# Altium schematic sheet LM74910H_PINOUT.SchDoc
size B; SheetNumber: 14; SheetTotal: 21
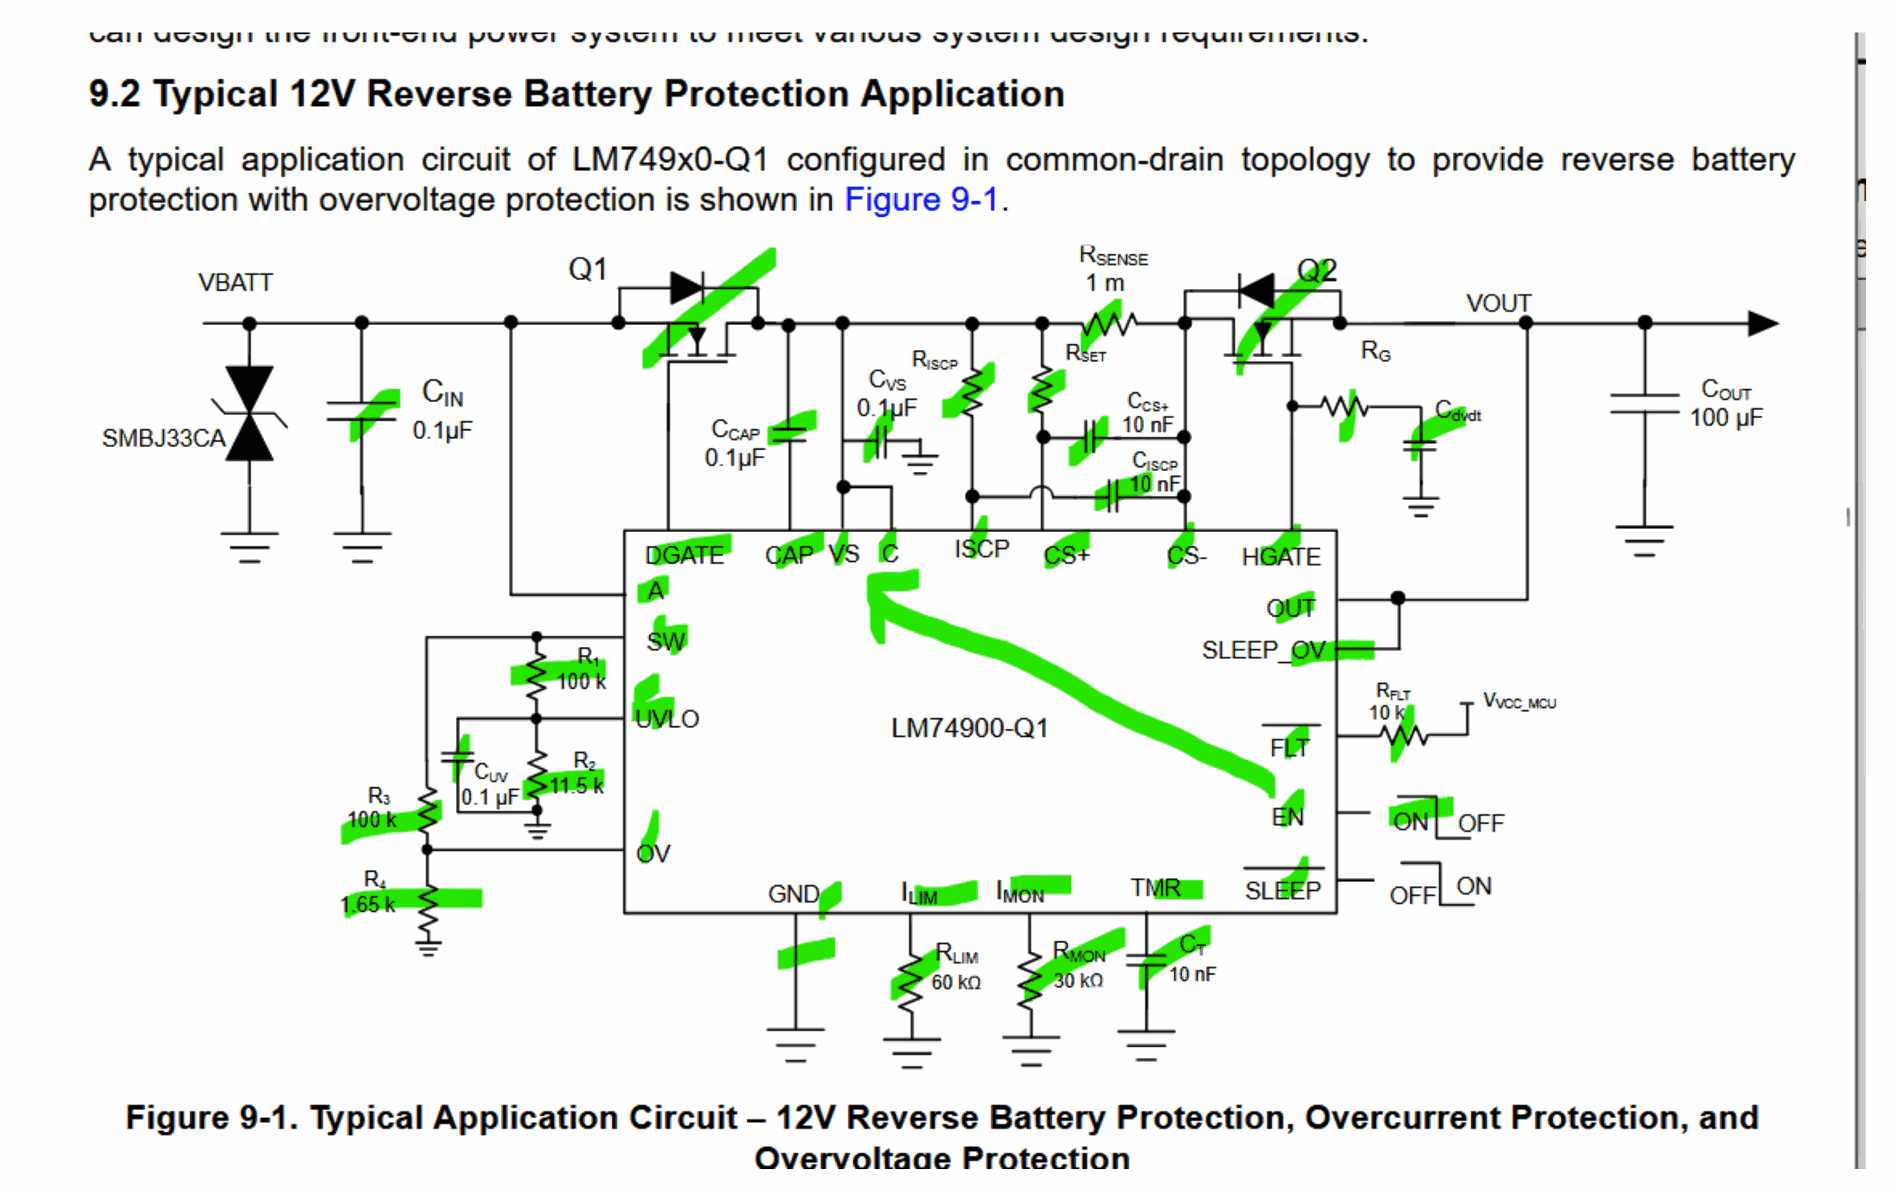
[diagram p0: LM74910H_PINOUT.SchDoc, top]
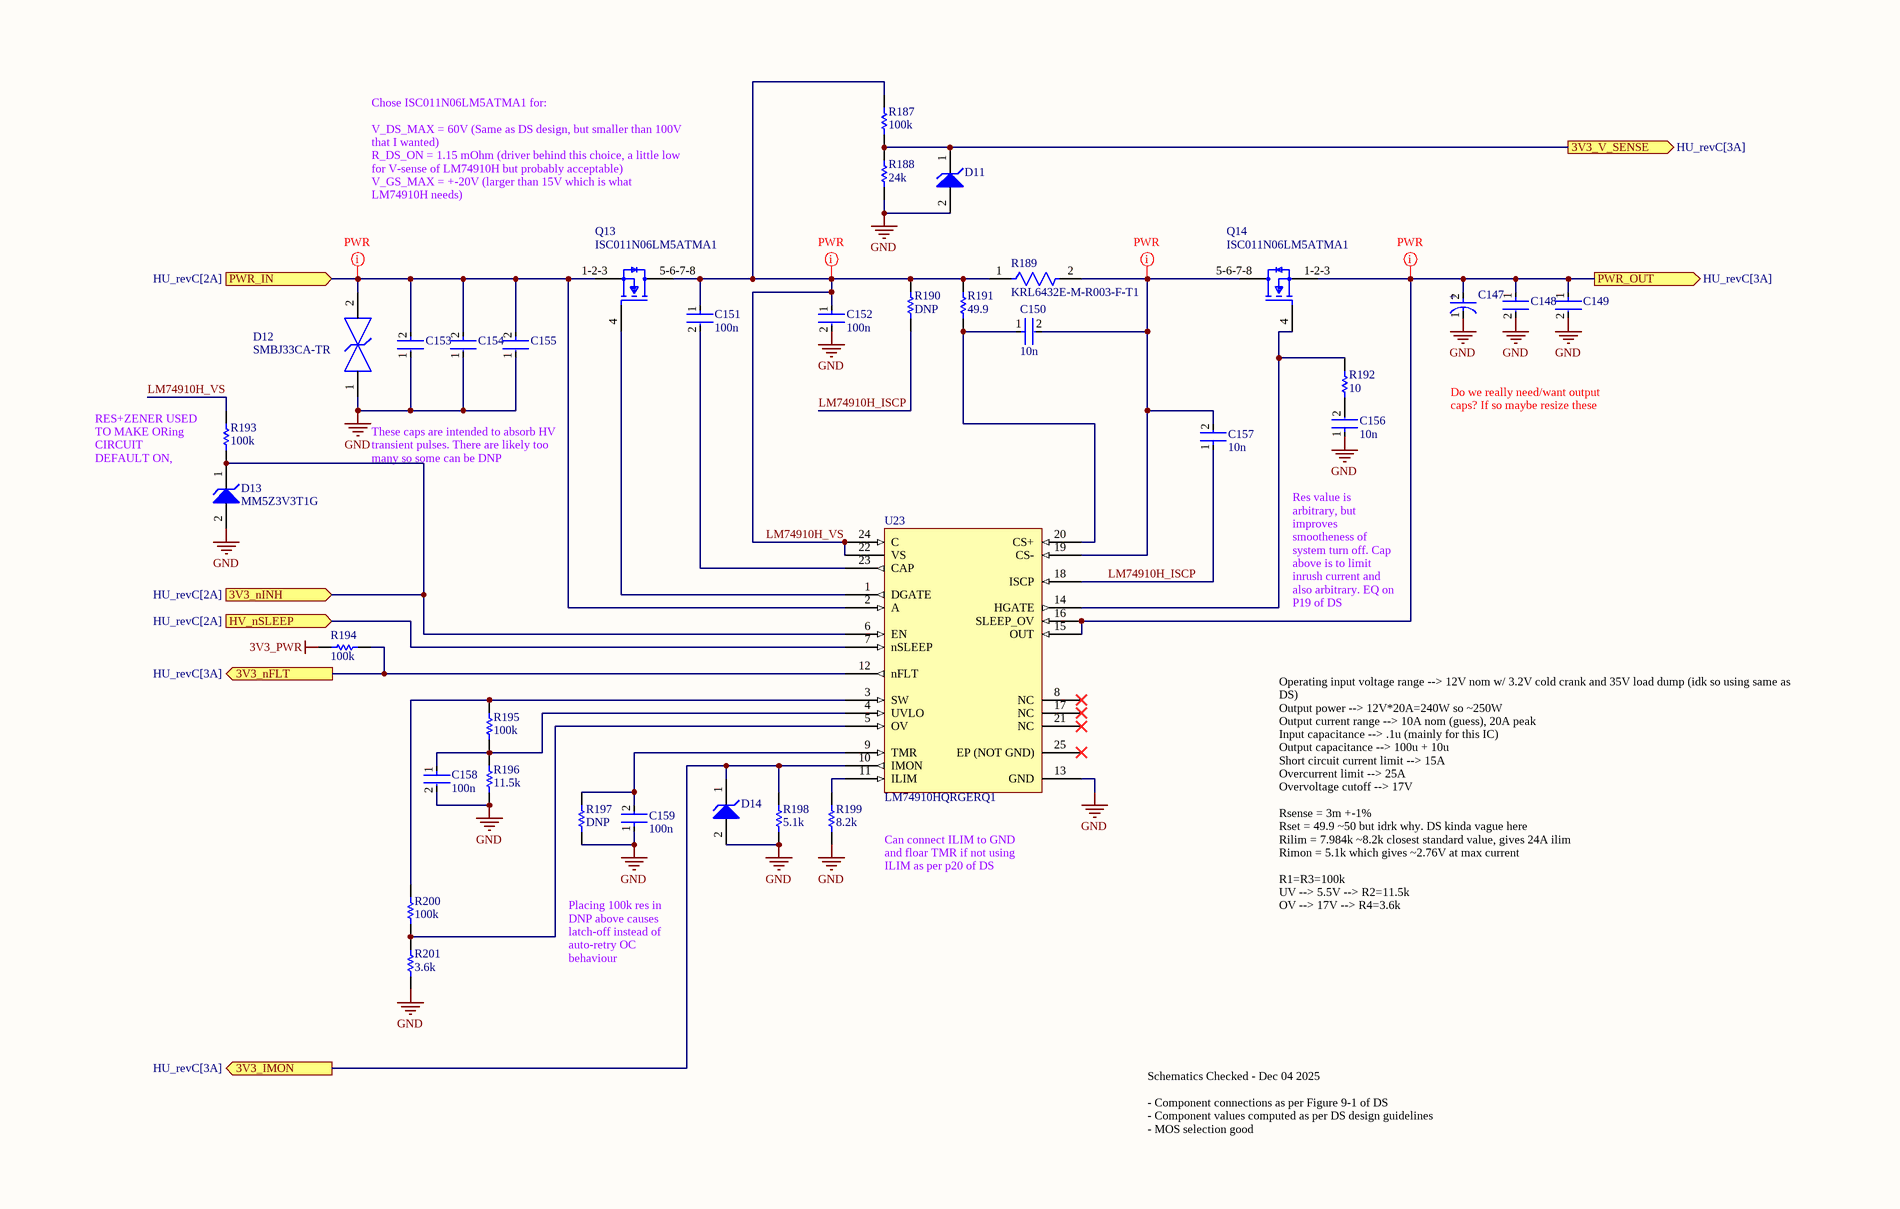
[diagram p1: LM74910H_PINOUT.SchDoc, bottom]

## Parts
C147  EEE-FK1H100UR  [FP-FKC-MFG]  (value not drawn)
C148  12103D106KAT2A  [FP-1210-L_3_3_0_4-W_2_5_0-MFG]  (value not drawn)
C149  12103D106KAT2A  [FP-1210-L_3_3_0_4-W_2_5_0-MFG]  (value not drawn)
C150  10n  [FP-0402-L_1_0_0_05-W_0_5-IPC_A]
C151  100n  [FP-0402-L_1_0_0_05-W_0_5-IPC_A]
C152  100n  [FP-0402-L_1_0_0_05-W_0_5-IPC_A]
C153  AC1210KKX7R0BB104  [FP-AC1210-0_85-MFG]  (value not drawn)
C154  AC1210KKX7R0BB104  [FP-AC1210-0_85-MFG]  (value not drawn)
C155  AC1210KKX7R0BB104  [FP-AC1210-0_85-MFG]  (value not drawn)
C156  10n  [FP-0402-L_1_0_0_05-W_0_5-IPC_A]
C157  10n  [FP-0402-L_1_0_0_05-W_0_5-IPC_A]
C158  100n  [FP-0402-L_1_0_0_05-W_0_5-IPC_A]
C159  100n  [FP-0402-L_1_0_0_05-W_0_5-IPC_A]
D11  DNP/MM5Z3V3T1G  [ONSC-SOD-523-2-502-01_V]  (value not drawn)
D12  SMBJ33CA-TR  [FP-SMB-CA-MFG]
D13  MM5Z3V3T1G  [ONSC-SOD-523-2-502-01_V]
D14  DNP/MM5Z3V3T1G  [ONSC-SOD-523-2-502-01_V]  (value not drawn)
Q13  ISC011N06LM5ATMA1  [FP-PG-TDSON-8-MFG]
Q14  ISC011N06LM5ATMA1  [FP-PG-TDSON-8-MFG]
R187  100k  [R0603B]
R188  24k  [R0603B]
R189  KRL6432E-M-R003-F-T1  [FP-KRL6432E-MFG]
R190  DNP  [R0603B]
R191  49.9  [R0603B]
R192  10  [R0603B]
R193  100k  [R0603B]
R194  100k  [R0603B]
R195  100k  [R0603B]
R196  11.5k  [R0603B]
R197  DNP  [R0603B]
R198  5.1k  [R0603B]
R199  8.2k  [R0603B]
R200  100k  [R0603B]
R201  3.6k  [R0603B]
U23  LM74910HQRGERQ1  [QFN50P400X400X100_HS-25N]

## Ports
3V3_IMON (out, see HU_revC[3A]), 3V3_nFLT (out, see HU_revC[3A]), 3V3_nINH (in, see HU_revC[2A]), 3V3_V_SENSE (out, see HU_revC[3A]), HV_nSLEEP (in, see HU_revC[2A]), PWR_IN (in, see HU_revC[2A]), PWR_OUT (out, see HU_revC[3A])

## Nets
3V3_PWR: R194.2
GND: C147.1(C) C148.2 C149.2 C152.2 C153.1 C154.1 C155.1 C156.1 C158.2 C159.1 D11.2(A) D12.1 D13.2(A) D14.2(A) R188.1 R196.1 R197.1 R198.1 R199.1 R201.1 U23.13(GND)
3V3_IMON: D14.1(K) R198.2 U23.10(IMON) ; port 3V3_IMON
3V3_nFLT: R194.1 U23.12(nFLT) ; port 3V3_nFLT
3V3_nINH: D13.1(K) R193.1 U23.6(EN) ; port 3V3_nINH
3V3_V_SENSE: D11.1(K) R187.1 R188.2 ; port 3V3_V_SENSE
HV_nSLEEP: U23.7(nSLEEP) ; port HV_nSLEEP
LM74910H_ISCP: C157.1 R190.1 U23.18(ISCP)
LM74910H_VS: C151.1 C152.1 Q13.5-6-7-8(D) R187.2 R189.1 R190.2 R191.2 R193.2 U23.22(VS) U23.24(C)
PWR_IN: C153.2 C154.2 C155.2 D12.2 Q13.1-2-3(S) U23.2(A) ; port PWR_IN
PWR_OUT: C147.2(A) C148.1 C149.1 Q14.1-2-3(S) U23.15(OUT) U23.16(SLEEP_OV) ; port PWR_OUT
NetC150_1: C150.1 R191.1 U23.20(CS+)
NetC150_2: C150.2 C157.2 Q14.5-6-7-8(D) R189.2 U23.19(CS-)
NetC151_2: C151.2 U23.23(CAP)
NetC156_2: C156.2 R192.1
NetC158_1: C158.1 R195.1 R196.2 U23.4(UVLO)
NetC159_2: C159.2 R197.2 U23.9(TMR)
NetQ13_4: Q13.4(G) U23.1(DGATE)
NetQ14_4: Q14.4(G) R192.2 U23.14(HGATE)
NetR195_2: R195.2 R200.2 U23.3(SW)
NetR199_2: R199.2 U23.11(ILIM)
NetR200_1: R200.1 R201.2 U23.5(OV)

Not connected (* = marked no-connect by the designer): U23 8(NC)* 17(NC)* 21(NC)* 25(EP_(NOT_GND))*

## Layout directives
net class PWR: LM74910H_VS, NetC150_2, PWR_IN, PWR_OUT

## Notes on the sheet
- Chose ISC011N06LM5ATMA1 for:
  V_DS_MAX = 60V (Same as DS design, but smaller than 100V that I wanted)
  R_DS_ON = 1.15 mOhm (driver behind this choice, a little low for V-sense of LM74910H but probably acceptable)
  V_GS_MAX = +-20V (larger than 15V which is what LM74910H needs)
- RES+ZENER USED TO MAKE ORing CIRCUIT DEFAULT ON, CAN BE DNP
- These caps are intended to absorb HV transient pulses. There are likely too many so some can be DNP
- Do we really need/want output caps? If so maybe resize these
- Res value is arbitrary, but improves smootheness of system turn off. Cap above is to limit inrush current and also arbitrary. EQ on P19 of DS
- Can connect ILIM to GND and floar TMR if not using ILIM as per p20 of DS
- Placing 100k res in DNP above causes latch-off instead of auto-retry OC behaviour
- Operating input voltage range --> 12V nom w/ 3.2V cold crank and 35V load dump (idk so using same as DS)
  Output power --> 12V*20A=240W so ~250W
  Output current range --> 10A nom (guess), 20A peak
  Input capacitance --> .1u (mainly for this IC)
  Output capacitance --> 100u + 10u
  Short circuit current limit --> 15A
  Overcurrent limit --> 25A
  Overvoltage cutoff --> 17V
  Rsense = 3m +-1%
  Rset = 49.9 ~50 but idrk why. DS kinda vague here
  Rilim = 7.984k ~8.2k closest standard value, gives 24A ilim
  Rimon = 5.1k which gives ~2.76V at max current
  R1=R3=100k
  UV --> 5.5V --> R2=11.5k
  OV --> 17V --> R4=3.6k
- Schematics Checked - Dec 04 2025
  - Component connections as per Figure 9-1 of DS
  - Component values computed as per DS design guidelines
  - MOS selection good
- (in symbol CMP-05427-000030-1) +

## Library data of the parts
C147 = CMP-05427-000030-1: CAP ALUM 10UF 20% 50V SMD; Impedance: 1.52R; Ripple Current (AC): 85mA; Life (Hours): 2000Hour; Leakage Current: 3uA; Dielectric Material: Aluminium; Length: 5.8mm; Voltage Rating: 50V; Radiation Hardening: No; Max Operating Temperature: 105°C; REACH SVHC: No SVHC; Tolerance: 20%; RoHS Compliant: Yes; Case/Package: Radial; Height: 5.8mm; Voltage: 50V; Diameter: 5mm; Number of Pins: 2; Ripple Current: 85mA; Series: FK; Lead Free: Lead Free; Width: 6.5mm; ESR (Equivalent Series Resistance): 1.52R; Package Quantity: 1000; Construction: Cylindrical; Voltage Rating (DC): 50V; Packaging: Tape and Reel; Height - Seated (Max): 0.228inch; Contact Plating: Tin; Capacitance: 10uF; Min Operating Temperature: -55°C; Termination: SMD/SMT; Material: Aluminium; Mount: Surface Mount
C148 C149 = CMP-2000-05477-2: General Purpose Ceramic Capacitor, 1210, 10uF, 10%, X5R, 15%, 25V; Lead Free: Lead Free; Max Operating Temperature: 85°C; REACH SVHC: No SVHC; Depth: 2.5mm; Packaging: Tape and Reel; Min Operating Temperature: -55°C; Height: 2.29mm; Construction: Flat; Case Code (Imperial): 1210; Radiation Hardening: No; Voltage: 25V; Case/Package: 1210; Series: -; Dielectric: X5R; Length: 3.2mm; Thickness: 0.11inch; Package Quantity: 1; Termination: SMD/SMT; Case Code (Metric): 3225; Voltage Rating (DC): 25V; Voltage Rating: 25V; Contact Plating: Tin; RoHS Compliant: Yes; Mount: Surface Mount; Width: 0.098inch; Capacitance: 10uF; Tolerance: 10%
C150-C152 C156-C159 = CMP-001-00058-1: LARGE PADS, 0402 CAP, CHANGE COMMENT TO MATCH REAL P/N; Capacitor Type: Ceramic; Min Operating Temperature: -55°C; Mounting Technology: Surface Mount; Pins: 2; Case/Package: 0402; RoHS Compliant: Yes; Max Operating Temperature: 85°C
C153-C155 = CMP-03422-000642-1: CAP CER 0.1UF 100V X7R 1210; Manufacturer: Yageo; Automotive Grade: Grade 1; Capacitance: 100 nF; Material: Ceramic; Value: 100 nF; Temperature Coefficient: 15%; Tolerance: 0.1; Automotive: Yes; ComponentLink2Description: Datasheet; Device Class L2: Capacitors; Height: 0.95mm; Manufacturer Part Number: AC1210KKX7R0BB104; Temperature: -55°C to +125°C; Voltage Rating: 100 V; Device Class L1: Passive Components; ComponentLink2URL: http://www.yageo.com/documents/recent/UPY-AC_NP0X7R_16V-to-630V_12.pdf; Lead Free: Yes; Category: Cap; Temperature Range High: +125°C; RoHS: TRUE; Digikey Description: CAP CER 0.1UF 100V X7R 1210; Temperature Range Low: -55°C; Octopart: https://octopart.com/ac1210kkx7r0bb104-yageo-78873719; Device Class L3: Ceramic Capacitors; Ipc Land Pattern Name: CAPC320250X85; Package: AC1210-0.85; Footprint Url: http://www.yageo.com/exep/pages/download/literatures/UPY-C_GEN_24.pdf; Temperature Characteristic: X7R
D11 D13 D14 = CMP-1060-00750-1: Zener Voltage Regulator, 500 mW, 2-Pin SOD-523, Pb-Free, Tape and Reel; Manufacturer: On Semiconductor; P Max (W): 0.5; VZ Typ (V): 3.3; RoHS: Pb-Free; ComponentLink2Description: Datasheet; PackageReference: SOD-523-2-502-01; DatasheetVersion: Rev. 10; ComponentLink1Description: Manufacturer URL; PackageVersion: Rev. E, 09/2010; ComponentLink3URL: http://www.onsemi.com/pub_link/Collateral/502-01.PDF; ComponentLink2URL: http://www.onsemi.cn/pub_link/Collateral/MM5Z2V4T1-D.PDF; Mounting Technology: Surface Mount; PartNumber: MM5Z3V3T1G; Packing: Tape and Reel; PackageDescription: 2-Pin SOD, Body 1.2 x 0.8 mm; ComponentLink1URL: http://www.onsemi.com/; ComponentLink3Description: Package Specification
D12 = CMP-12225-000040-1: TVS DIODE 33V 69.7V SMB; Manufacturer: STMicroelectronics; Direction: Bidirectional; Peak Pulse Current: 11.8A; Peak Pulse Power: 600W; Clamping Voltage: 53.3V; Breakdown Voltage: 36.7V; Number Of Channels: 1; Standoff Height: 0.05mm; Max Junction Temp: +150°C; Lead Free: Yes; Device Class L1: Circuit Protection; Device Class L3: unset; Mouser Description: TVS Diodes - Transient Voltage Suppressors 600W 33V Bidirect; Device Class L2: TVS Diodes; Temperature Range High: +150°C; Temperature: -55°C to +150°C; Temperature Range Low: -55°C; Octopart: https://octopart.com/smbj33ca-tr-stmicroelectronics-347069; Manufacturer Part Number: SMBJ33CA-TR; Automotive: No; ComponentLink2URL: https://www.st.com/resource/en/datasheet/smbj.pdf; RoHS: TRUE; Package: SMB-CA; Category: Diode; ComponentLink2Description: Datasheet; Height: 2.65mm; Reverse Standoff Voltage: 33V; Digikey Description: TVS DIODE 33V 69.7V SMB
Q13 Q14 = CMP-32901-001049-1: TRENCH 40<-<100V PG-TDSON-8
R187 R188 R190-R201 = CMP-009-00002-14: Resistor
R189 = CMP-00597-24927456-1: KRL6432E-M-R003-F-T1 Metal Foil Low Resistance Chip Resistor (long-side terminal), 2512, RoHS; Tolerance: 1%; Resistance: 3mΩ; Temperature Coefficient: 50ppm/°C; Power Rating: 3W; Height: 700µm; NexarPartId: 24927456; Termination: SMD/SMT; Case Code (Metric): 6432; Min Operating Temperature: -55°C; Length: 3.1mm; Weight: 40.511469mg; Width: 6.3mm; Lifecycle Status: Production; Max Operating Temperature: 155°C; Case Code (Imperial): 2512; Composition: Metal Foil; Case/Package: 2512; Max Thickness: 700µm; RoHS: Compliant
U23 = CMP-019-00057-2: Automotive ideal diode with circuit breaker, 200-kHz ACS, UV , OV protection and SLEEP mode 24-VQFN -40 to 125; Pins: 24; Case/Package: VQFN